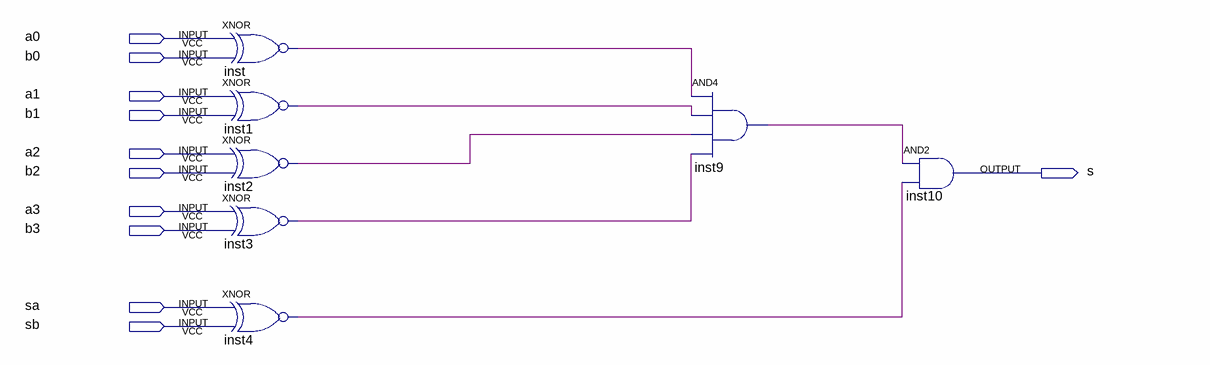
[diagram p0: schematic sheet]
// Quartus schematic igualigual.bdf as structural Verilog: 7 symbols, 11 pins
module igualigual (
  input  a0,
  input  b0,
  input  a1,
  input  b1,
  input  a2,
  input  b2,
  input  a3,
  input  b3,
  input  sa,
  input  sb,
  output s
);

  wire inst1_out, inst2_out, inst3_out, inst4_out, inst9_out, inst_out;

  xnor inst (inst_out, a0, b0);
  xnor inst1 (inst1_out, a1, b1);
  xnor inst2 (inst2_out, a2, b2);
  xnor inst3 (inst3_out, a3, b3);
  xnor inst4 (inst4_out, sa, sb);
  and inst9 (inst9_out, inst_out, inst1_out, inst2_out, inst3_out);
  and inst10 (s, inst9_out, inst4_out);
endmodule
